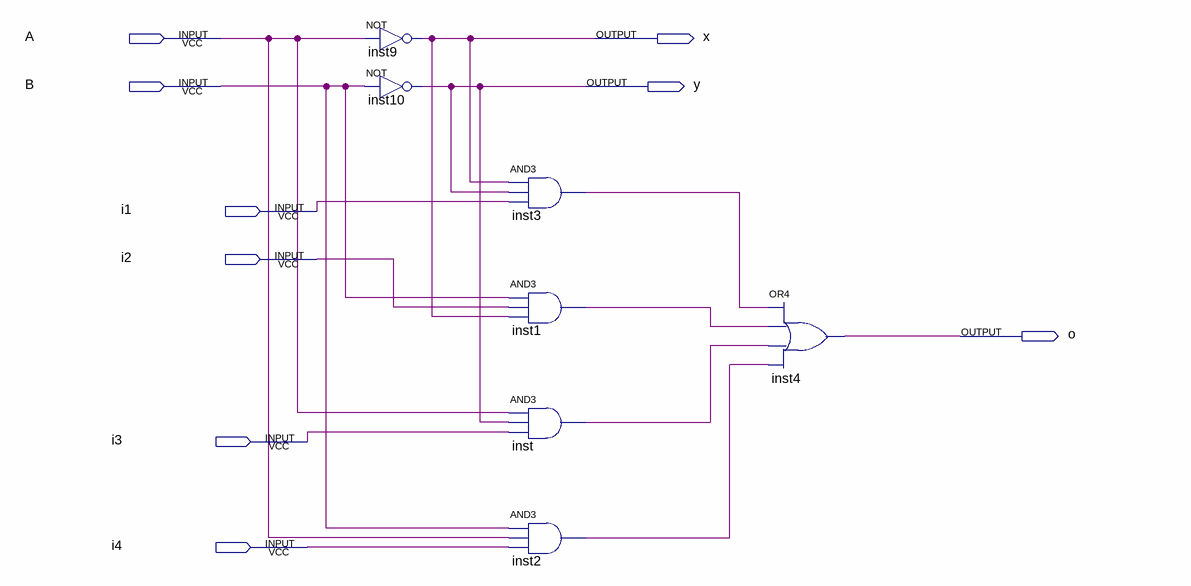
[diagram p0: schematic sheet]
// Quartus schematic mux.bdf as structural Verilog: 7 symbols, 9 pins
module mux (
  input  A,
  input  B,
  input  i1,
  input  i2,
  input  i3,
  input  i4,
  output x,
  output y,
  output o
);

  wire inst1_out, inst2_out, inst3_out, inst_out;

  not inst9 (x, A);
  not inst10 (y, B);
  and inst3 (inst3_out, x, y, i1);
  and inst1 (inst1_out, B, i2, x);
  and inst (inst_out, A, y, i3);
  and inst2 (inst2_out, B, A, i4);
  or inst4 (o, inst3_out, inst1_out, inst_out, inst2_out);
endmodule
